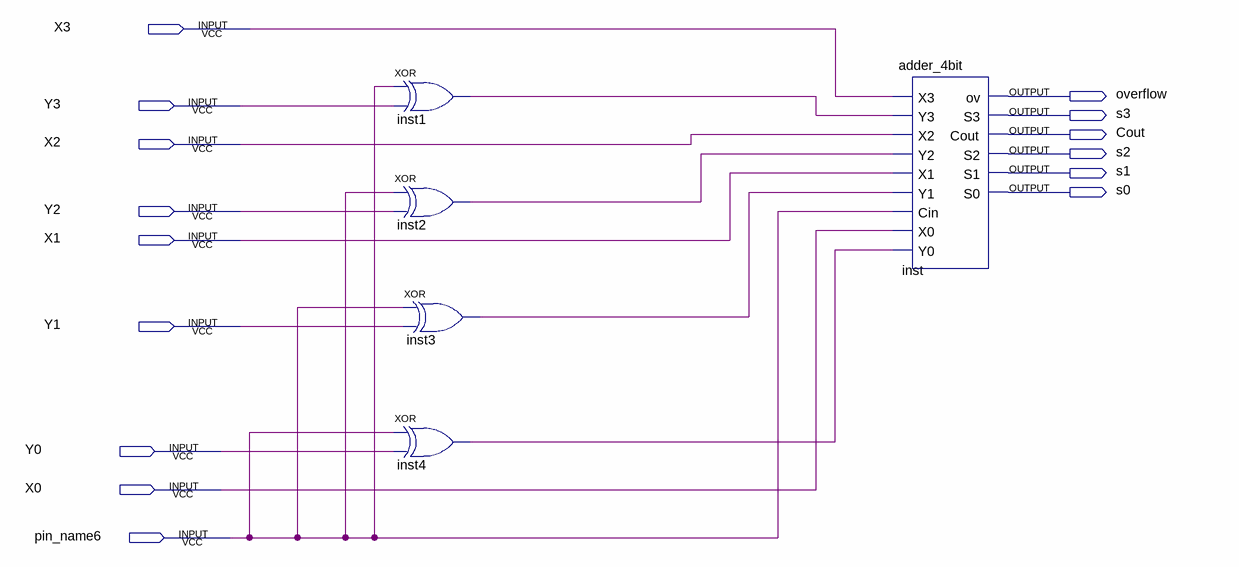
[diagram p0: schematic sheet]
// Quartus schematic adder_subtracter.bdf as structural Verilog: 5 symbols, 15 pins
module adder_subtracter (
  input  X3,
  input  Y3,
  input  X2,
  input  Y2,
  input  X1,
  input  Y1,
  input  Y0,
  input  X0,
  input  pin_name6,
  output overflow,
  output s3,
  output Cout,
  output s2,
  output s1,
  output s0
);

  wire inst1_out, inst2_out, inst3_out, inst4_out;

  xor inst1 (inst1_out, pin_name6, Y3);
  xor inst2 (inst2_out, pin_name6, Y2);
  xor inst3 (inst3_out, pin_name6, Y1);
  xor inst4 (inst4_out, pin_name6, Y0);
  adder_4bit inst (
    .X3(X3), .Y3(inst1_out), .X2(X2), .Y2(inst2_out), .X1(X1), .Y1(inst3_out), .Cin(pin_name6), .X0(X0),
    .Y0(inst4_out), .ov(overflow), .S3(s3), .Cout(Cout), .S2(s2), .S1(s1), .S0(s0));
endmodule
